# EasyEDA Pro project AT32M412_EVB_V0.4.eprj, board AT32M412_EVB_V0.4
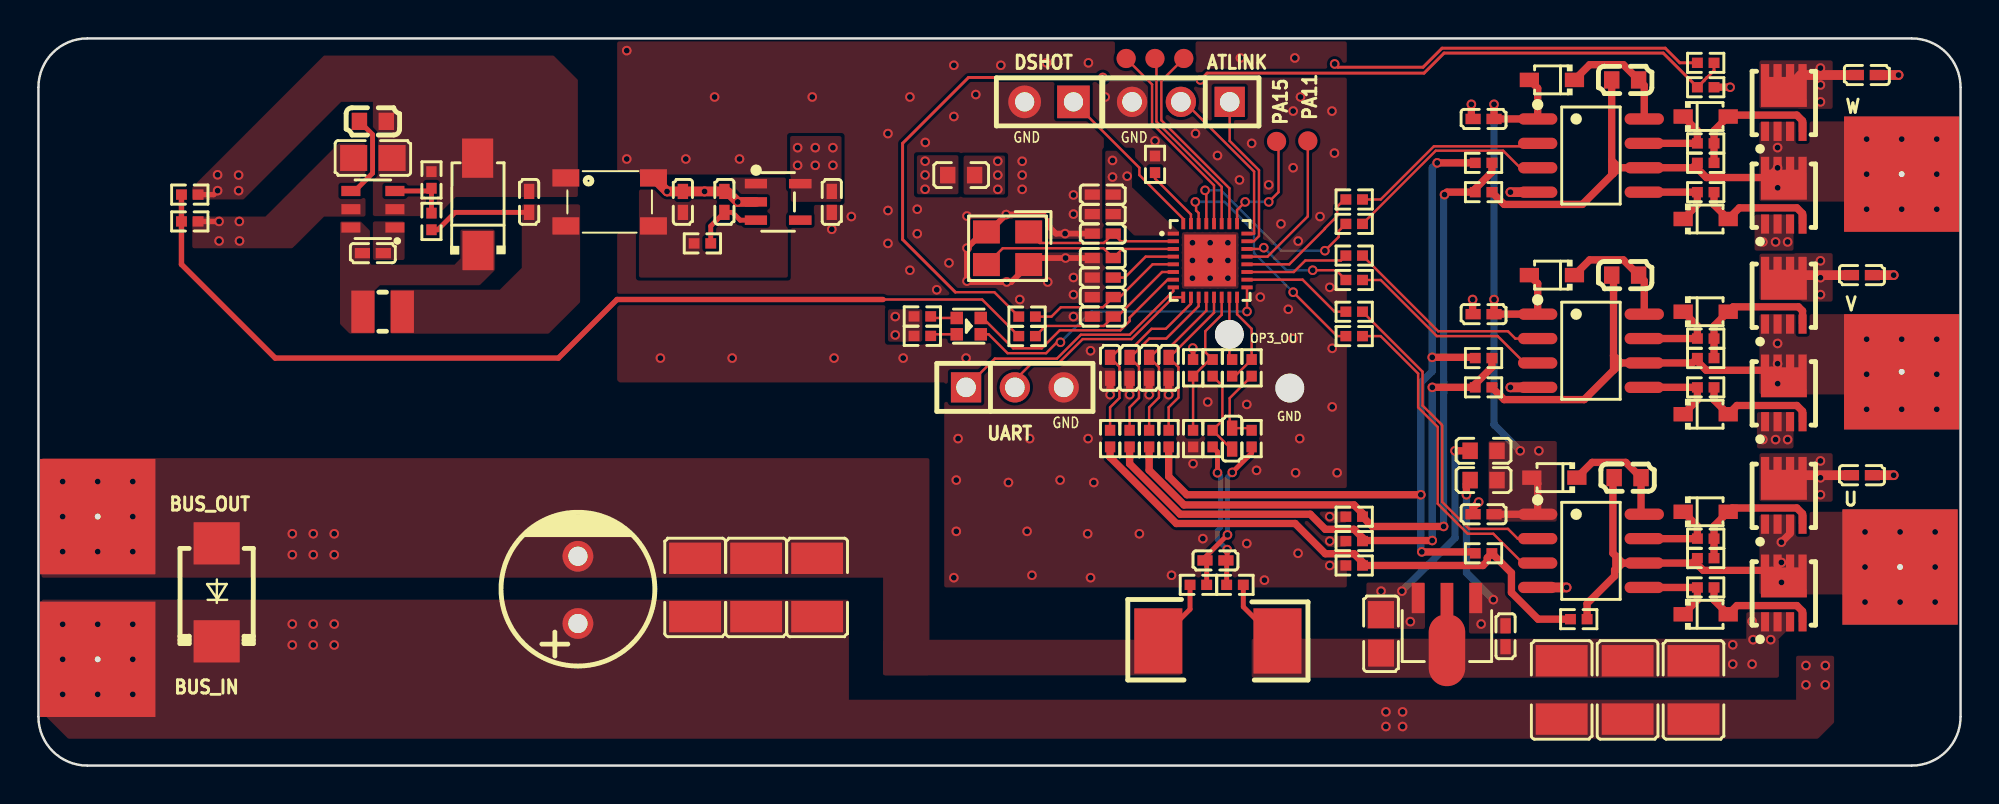
[diagram p4: board, top side]
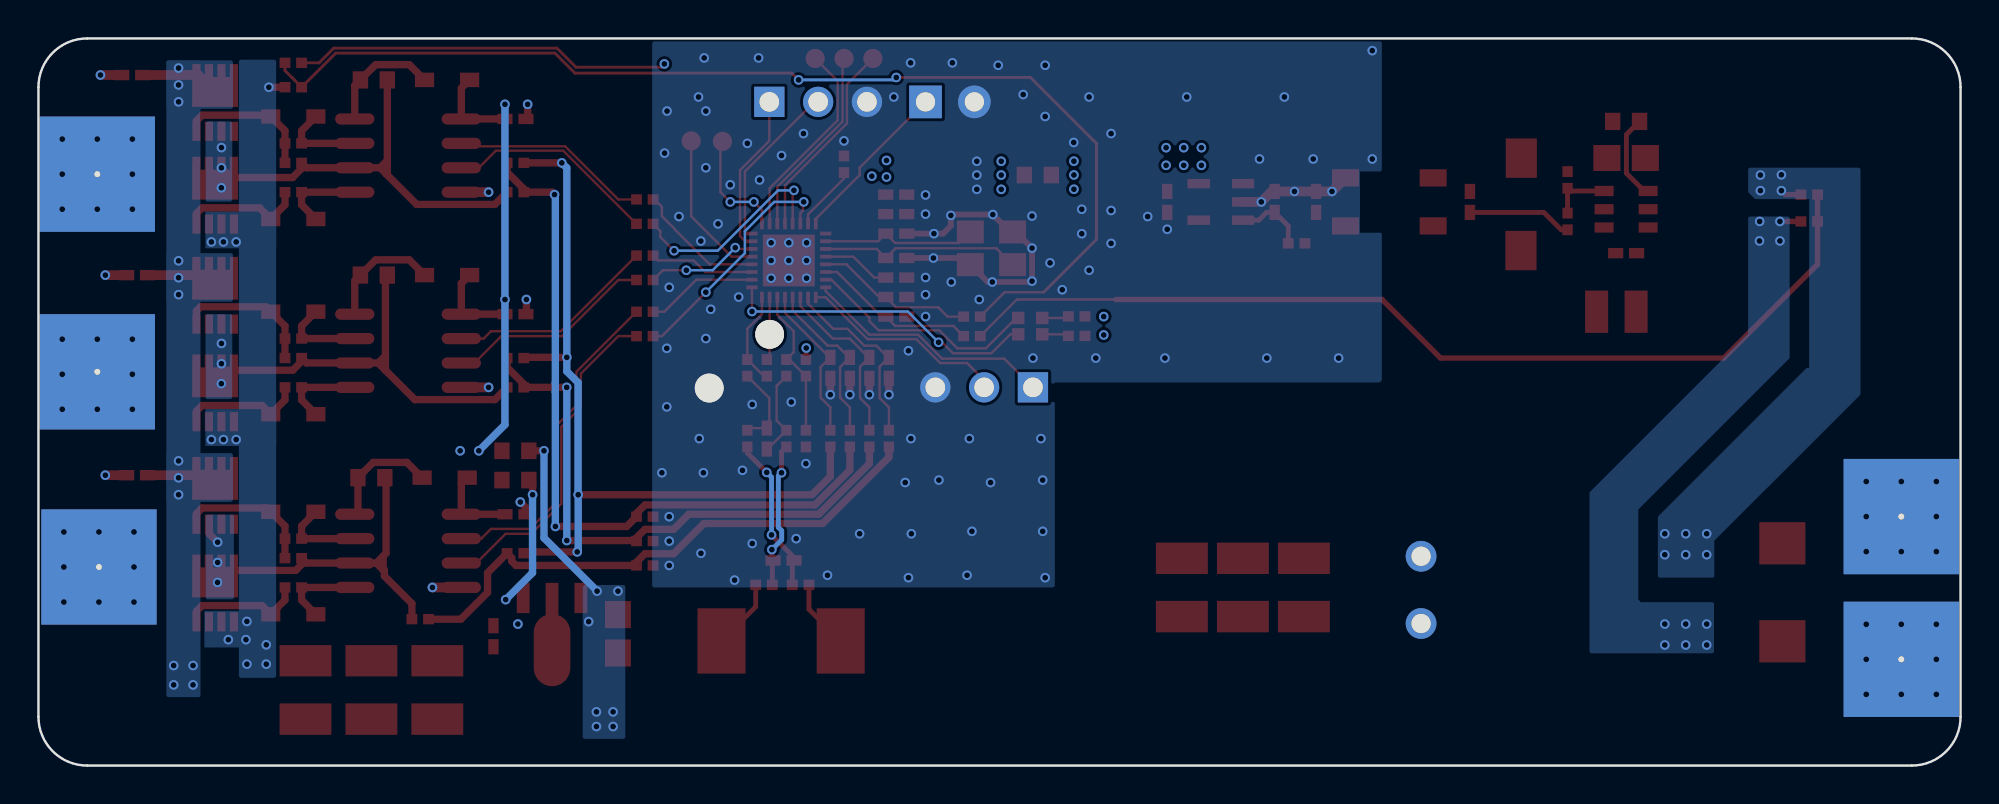
[diagram p5: board, bottom side, seen from below]

Outline 100 x 37.85 mm; copper layers: Top Layer, GND02, PWR03, Bottom Layer. Coordinates in mm from the lower left corner of the outline.
Outline path: 0,35.31 0,2.54 arc(0.74,0.74) 2.54,0 97.46,0 arc(99.26,0.74) 100,2.54 100,35.31 arc(99.26,37.1) 97.46,37.85 2.54,37.85 arc(0.74,37.1) 0,35.31
Stack: Top Layer 0.035mm 外层铜厚1oz / Dielectric1 0.2104mm 7628 RC49% 8.6mil / GND02 0.0152mm 内层铜厚 / Dielectric2 1.065mm 1.1mm H/HOZ Copper / PWR03 0.0152mm 内层铜厚 / Dielectric3 0.2104mm 7628 RC49% 8.6mil / Bottom Layer 0.035mm 外层铜厚1oz

## Design rules (mm)
template: 自定义配置
spacing copperThickness1oz (default): track to track 0.102, other pairs 0.152 to 0.3
spacing copperThickness2oz: track to track 0.203, other pairs 0.152 to 0.3
spacing edgeClearance: track to track 0.152, other pairs 0 to 0.152
track width copperThickness1oz (default): min 0.127, default 0.127, max 2.54
track width PWR: min 0.152, default 0.381, max 2.54
differential pair 90ohm (default): width min 0.152, default 0.152, max 0.152; gap min 0.178, default 0.178
via viaSize (default): diameter min 0.5, default 0.5, max 10; hole min 0.3, default 0.305, max 6.299
net GND uses PWR
net VBUS uses PWR
net GNDP uses PWR
net VCC_3V3 uses PWR
region e1533 uses edgeClearance
region e1534 uses edgeClearance
region e2249 uses edgeClearance
region e2274 uses edgeClearance
region e2275 uses edgeClearance

## Placement (name value [footprint] x y rotation side)
ATLINK  PM254V-11-03-H85  [HDR-TH_3P-P2.54-V-F]  59.44 34.54 180 top
BUS_IN  -  [PAD_35A]  4.35 5.02 180 top
BUS_OUT  -  [PAD_35A]  4.35 12.45 180 top
C131  100nF  [C0402]  55.37 28.7 0 top
C205  220uF  [CAP-TH_BD8.0-P3.50-D0.6-FD]  28.07 9.14 90 top
C208  10uF  [C0805]  17.4 31.62 180 top
C210  10uF  [C0402]  25.53 29.34 270 top
C211  100nF  [C0402]  55.37 25.4 0 top
C212  12pF  [C0402]  55.37 27.69 180 top
C213  12pF  [C0402]  55.37 26.42 0 top
C215  1uF  [C0603]  82.68 14.99 0 top
C217  1uF  [C0603]  82.55 25.53 0 top
C219  1uF  [C0603]  82.55 35.69 0 top
C220  2.2nF  [C0402]  61.23 10.68 180 top
C221  4.7uF  [C1210]  86.11 3.94 270 top
C225  100nF  [C0402]  55.37 23.37 0 top
C226  100nF  [C0402]  55.37 24.38 0 top
C227  33pF  [C0402]  55.75 20.7 90 top
C228  33pF  [C0402]  56.77 20.7 90 top
C229  33pF  [C0402]  57.79 20.7 90 top
C230  33pF  [C0402]  58.8 20.7 90 top
C231  100pF  [C0402]  62.1 17.02 270 top
C232  100nF  [C0402]  17.4 26.67 180 top
C234  10uF  [C0402]  33.53 29.34 270 top
C235  1uF  [C0402]  35.69 29.34 270 top
C236  1uF  [C0402]  41.27 29.34 90 top
C238  100nF  [C0402]  94.87 15.11 0 top
C239  100nF  [C0402]  94.87 25.53 0 top
C240  100nF  [C0402]  95.12 35.94 0 top
C241  100nF  [C0402]  76.33 6.73 270 top
C242  2.2uF  [C0603]  17.4 33.53 180 top
C245  4.7uF  [C1210]  34.16 9.27 270 top
C246  4.7uF  [C1210]  37.34 9.27 270 top
C247  4.7uF  [C1210]  40.51 9.27 270 top
C249  4.7uF  [C1210]  82.68 3.94 270 top
C250  4.7uF  [C1210]  79.25 3.94 270 top
C252  330nF  [C0805]  69.85 6.86 90 top
C253  10uF  [C0402]  55.37 29.72 0 top
C254  100nF  [C0402]  75.18 13.08 180 top
C255  100nF  [C0402]  75.18 23.5 180 top
C256  100nF  [C0402]  75.18 33.66 180 top
D37  1N4148WS  [SOD-323_L1.8-W1.3-LS2.5-RD]  78.87 14.99 180 top
D38  1N4148WS  [SOD-323_L1.8-W1.3-LS2.5-RD]  78.74 25.53 180 top
D39  1N4148WS  [SOD-323_L1.8-W1.3-LS2.5-RD]  78.74 35.69 180 top
D40  1N4148WS  [SOD-323_L1.8-W1.3-LS2.5-RD]  86.74 13.21 0 top
D41  1N4148WS  [SOD-323_L1.8-W1.3-LS2.5-RD]  86.74 23.62 0 top
D42  1N4148WS  [SOD-323_L1.8-W1.3-LS2.5-RD]  86.74 33.78 0 top
D43  1N4148WS  [SOD-323_L1.8-W1.3-LS2.5-RD]  86.74 7.87 0 top
D44  1N4148WS  [SOD-323_L1.8-W1.3-LS2.5-RD]  86.74 18.29 0 top
D45  1N4148WS  [SOD-323_L1.8-W1.3-LS2.5-RD]  86.74 28.45 0 top
D46  SS16  [SMA_L4.3-W2.6-LS5.0-RD]  22.86 29.21 90 top
DSHOT  2.54-1*2P母  [HDR-TH_2P-P2.54-V-F]  52.58 34.54 180 top
GND  -  [M3.5金属化螺丝孔]  65.1 19.65 0 top
L12  ACT45B-510-2P-TL003  [IND-SMD_4P-L4.5-W3.2-TL]  29.72 29.34 0 top
L13  BLM18AG102SN1D  [L0603]  48.01 30.73 0 top
L14  BLM18AG102SN1D  [L0603]  75.18 14.86 0 top
L15  NC  [L0603]  75.18 16.38 0 top
L16  10uH  [IND-SMD_L2.5-W2.0]  17.91 23.62 0 top
LDO1  ME6211C33M5G-N  [SOT-23-5_L3.0-W1.7-P0.95-LS2.8-BL]  38.48 29.34 270 top
LED1  NCD1615RG1  [LED-SMD_4P-L1.6-W1.5-TL-1]  48.4 22.87 180 top
OP3_OUT  -  [M3.5金属化螺丝孔]  61.96 22.44 0 top
PA11  -  [Mark-Point-1mm]  66.04 32.51 90 top
PA15  -  [Mark-Point-1mm]  64.41 32.48 90 top
PB3  -  [Mark-Point-1mm]  59.59 36.8 90 top
PB4  -  [Mark-Point-1mm]  58.09 36.8 90 top
PB5  -  [Mark-Point-1mm]  56.59 36.8 90 top
Q1  TMG60N04DF  [POWERDI3333-8_DMN7022LFGQ-7]  90.8 13.59 0 top
Q2  TMG60N04DF  [POWERDI3333-8_DMN7022LFGQ-7]  90.8 8.51 0 top
Q3  TMG60N04DF  [POWERDI3333-8_DMN7022LFGQ-7]  90.8 24 0 top
Q4  TMG60N04DF  [POWERDI3333-8_DMN7022LFGQ-7]  90.8 18.92 0 top
Q5  TMG60N04DF  [POWERDI3333-8_DMN7022LFGQ-7]  90.8 34.04 0 top
Q6  TMG60N04DF  [POWERDI3333-8_DMN7022LFGQ-7]  90.8 29.21 0 top
R186  82kΩ  [R0402]  20.45 28.32 90 top
R188  1kΩ  [R0402]  58.09 31.29 90 top
R189  1kΩ  [R0402]  45.99 23.38 0 top
R190  1kΩ  [R0402]  45.99 22.36 0 top
R191  10Ω  [R0402]  86.74 11.81 0 top
R192  10Ω  [R0402]  86.74 9.27 0 top
R193  10Ω  [R0402]  86.74 22.22 0 top
R194  10Ω  [R0402]  86.74 19.69 0 top
R195  10Ω  [R0402]  86.74 32.39 0 top
R196  10Ω  [R0402]  86.74 29.84 0 top
R197  10Ω  [R0402]  68.45 23.62 0 top
R198  10Ω  [R0402]  68.45 22.35 0 top
R199  10Ω  [R0402]  68.45 26.54 0 top
R200  10Ω  [R0402]  68.45 25.27 0 top
R201  10Ω  [R0402]  68.45 29.46 0 top
R202  10Ω  [R0402]  68.45 28.19 0 top
R203  2mΩ  [RES-SMD_L6.4-W3.2-1]  61.36 6.49 180 top
R204  10Ω  [R0402]  62.25 9.41 0 top
R205  10Ω  [R0402]  60.35 9.41 180 top
R206  NCP15XH103F03RC  [R0402]  86.74 35.31 180 top
R207  3kΩ  [R0402]  86.74 36.58 180 top
R208  100Ω  [R0402]  51.43 22.35 0 top
R209  100Ω  [R0402]  51.43 23.37 0 top
R211  51kΩ  [R0402]  75.18 11.05 0 top
R213  3kΩ  [R0402]  68.45 10.41 180 top
R214  43kΩ  [R0402]  80.14 7.62 0 top
R215  51kΩ  [R0402]  75.18 21.21 0 top
R216  43kΩ  [R0402]  75.18 19.69 0 top
R217  3kΩ  [R0402]  68.45 11.68 180 top
R218  51kΩ  [R0402]  75.18 31.37 0 top
R219  43kΩ  [R0402]  75.18 29.84 0 top
R220  3kΩ  [R0402]  68.45 12.95 180 top
R221  1Ω  [R0402]  55.75 17.02 90 top
R222  1Ω  [R0402]  56.77 17.02 90 top
R223  1Ω  [R0402]  57.79 17.02 90 top
R224  1Ω  [R0402]  58.8 17.02 90 top
R225  1.2kΩ  [R0402]  61.09 17.02 90 top
R226  1.2kΩ  [R0402]  63.12 17.02 90 top
R227  1.2kΩ  [R0402]  61.09 20.7 90 top
R228  1.2kΩ  [R0402]  63.12 20.7 90 top
R229  66.5kΩ  [R0402]  62.1 20.7 90 top
R230  47kΩ  [R0402]  7.87 28.32 180 top
R231  10kΩ  [R0402]  7.87 29.72 0 top
R237  133kΩ  [R0402]  60.07 20.7 270 top
R238  133kΩ  [R0402]  60.07 17.02 90 top
R239  200kΩ  [R0402]  86.74 10.8 0 top
R240  200kΩ  [R0402]  86.74 21.21 0 top
R241  200kΩ  [R0402]  86.74 31.37 0 top
R242  16kΩ  [R0402]  20.45 30.48 90 top
R243  10kΩ  [R0402]  34.54 27.18 180 top
U  -  [PAD_35A]  95.58 10.84 0 top
U34  AT32M412KBU7-4  [WQFN-32_L4.0-W4.0-P0.40-TL-EP2.7]  60.96 26.29 0 top
U41  SMBJ18A  [SMB_L4.5-W3.6-LS5.4-RD]  9.27 9.02 90 top
U43  CJ78L12  [SOT-89-3_L4.5-W2.5-P1.50-LS4.2-BR]  73.28 7.37 90 top
U44  LGS5145  [SOT-23-6_L2.9-W1.7-P0.95-LS2.8-BL]  17.4 28.96 90 top
U45  IRS21867STRPBF-JSM  [SOIC-8_L4.9-W3.9-P1.27-LS6.0-BL]  80.77 11.18 270 top
U46  IRS21867STRPBF-JSM  [SOIC-8_L4.9-W3.9-P1.27-LS6.0-BL]  80.77 21.59 270 top
U47  IRS21867STRPBF-JSM  [SOIC-8_L4.9-W3.9-P1.27-LS6.0-BL]  80.77 31.75 270 top
UART  PM254V-11-03-H85  [HDR-TH_3P-P2.54-V-F]  50.8 19.69 0 top
V  -  [PAD_35A]  95.67 21 0 top
W  -  [PAD_35A]  95.67 31.29 0 top
X3  24MHz  [CRYSTAL-SMD_4P-L3.2-W2.5-BL]  50.42 26.92 180 top

## Footprints (pads in the part's own frame, mm; a bottom-side part is the same pattern mirrored in y, then rotated)
C0402
  rect 0.79x0.54 smd: 1(-0.545,0) 2(0.545,0)
C0603
  rect 0.8x0.9 smd: 1(-0.7,0) 2(0.7,0)
C0805
  rect 1.41x1.35 smd: 1(-1,0) 2(1,0)
C1210
  rect 1.635x2.7 smd: 1(-1.518,0) 2(1.518,0)
CAP-TH_BD8.0-P3.50-D0.6-FD
  round 1.6 hole 1: 1(-1.75,0) 2(1.75,0)
CRYSTAL-SMD_4P-L3.2-W2.5-BL
  rect 1.4x1.2 smd: 1(-1.1,-0.85) 2(1.1,-0.85) 3(1.1,0.85) 4(-1.1,0.85)
HDR-TH_2P-P2.54-V-F
  rect 1.7x1.7 hole 1: 1(-1.27,0)
  round 1.7 hole 1: 2(1.27,0)
HDR-TH_3P-P2.54-V-F
  rect 1.575x1.575 hole 1.02: 1(-2.54,0)
  round 1.575 hole 1.02: 2(0,0) 3(2.54,0)
IND-SMD_4P-L4.5-W3.2-TL
  rect 1.4x0.9 smd: 1(-2.28,1.25) 2(-2.28,-1.25) 3(2.28,-1.25) 4(2.28,1.25)
IND-SMD_L2.5-W2.0
  rect 1.2x2.2 smd: 1(1.028,0) 2(-1.028,0)
L0603
  rect 0.8x0.864 smd: 1(-0.7,0) 2(0.7,0)
LED-SMD_4P-L1.6-W1.5-TL-1
  rect 0.65x0.65 smd: 1(-0.625,0.425) 2(0.625,0.425) 3(-0.625,-0.425) 4(0.625,-0.425)
M3.5金属化螺丝孔
  round 1.5 hole 3.5x1: 1(0,0)
Mark-Point-1mm
  round 1 smd: 1(0,0)
PAD_35A
  rect 6x6 hole 0.305: 1(1.27,-0.508)
POWERDI3333-8_DMN7022LFGQ-7
  rect 0.42x1 smd: 1(-0.975,-1.025) 2(-0.325,-1.025) 3(0.325,-1.025) 4(0.975,-1.025)
  custom 2.39x2.23 smd: 5(0.005,1.025)
R0402
  rect 0.566x0.54 smd: 1(-0.433,0) 2(0.433,0)
RES-SMD_L6.4-W3.2-1
  rect 2.5x3.4 smd: 1(-3.1,0) 2(3.1,0)
SMA_L4.3-W2.6-LS5.0-RD
  rect 2.046x1.62 smd: 1(-2.404,-0.009) 2(2.404,0.009)
SMB_L4.5-W3.6-LS5.4-RD
  rect 2.2x2.4 smd: 1(-2.551,0) 2(2.551,0)
SOD-323_L1.8-W1.3-LS2.5-RD
  rect 1x0.75 smd: 1(-1.173,0) 2(1.173,0)
SOIC-8_L4.9-W3.9-P1.27-LS6.0-BL
  oval 0.588x2.045 smd: 1(-1.905,-2.772) 2(-0.635,-2.772) 3(0.635,-2.772) 4(1.905,-2.772) 5(1.905,2.772) 6(0.635,2.772) 7(-0.635,2.772) 8(-1.905,2.772)
SOT-23-5_L3.0-W1.7-P0.95-LS2.8-BL
  rect 0.49x1.157 smd: 1(-0.95,-1.153) 2(0,-1.153) 3(0.95,-1.153)
  rect 0.49x1.175 smd: 4(0.95,1.153) 5(-0.95,1.153)
SOT-23-6_L2.9-W1.7-P0.95-LS2.8-BL
  rect 0.532x0.99 smd: 1(-0.95,-1.145) 2(0,-1.145) 3(0.95,-1.145) 4(0.95,1.145) 5(0,1.145) 6(-0.95,1.145)
SOT-89-3_L4.5-W2.5-P1.50-LS4.2-BR
  rect 1.575x0.672 smd: 1(1.356,-1.5) 3(1.356,1.5)
  custom 5.377x1.9 smd: 2(-1.356,0)
WQFN-32_L4.0-W4.0-P0.40-TL-EP2.7
  rect 0.585x0.2 smd: 1(-1.917,1.4) 2(-1.917,1) 3(-1.917,0.6) 4(-1.917,0.2) 5(-1.917,-0.2) 6(-1.917,-0.6) 7(-1.917,-1) 8(-1.917,-1.4) 17(1.917,-1.4) 18(1.917,-1) 19(1.917,-0.6) 20(1.917,-0.2) 21(1.917,0.2) 22(1.917,0.6) 23(1.917,1) 24(1.917,1.4)
  rect 0.2x0.585 smd: 9(-1.4,-1.917) 10(-1,-1.917) 11(-0.6,-1.917) 12(-0.2,-1.917) 13(0.2,-1.917) 14(0.6,-1.917) 15(1,-1.917) 16(1.4,-1.917) 25(1.4,1.917) 26(1,1.917) 27(0.6,1.917) 28(0.2,1.917) 29(-0.2,1.917) 30(-0.6,1.917) 31(-1,1.917) 32(-1.4,1.917)
  rect 2.7x2.7 smd: 33(0,0)

## Nets
As in the schematic.

Pads without a net: LDO1 4

## Via types
v1: diameter 0.5, hole 0.305, Top Layer to Bottom Layer, 278 vias

## Routing (per net, layer and track width the routed paths; a pad name or vN(x,y) marks a point on that pad's centre or on a via; arc(x,y) is an arc through that point)
GND: length 26
  Top Layer w0.305: C212.2 v1(53.41,27.69) 52.94,27.69 52.53,28.09 v1(52.53,28.63) 52.48,28.68 v1(50.35,28.68) 49.44,27.77 X3.2 49.15,27.77 v1(48.31,26.93) v1(48.31,25.22) 48.35,25.17 50.61,25.17 X3.4 51.86,26.42 v1(53.44,26.42) C213.1
  Top Layer w0.381: C230.1 v1(58.8,19.3) ; C229.1 v1(57.79,19.3) ; C227.1 v1(55.75,19.3) ; C228.1 v1(56.77,19.3)
  Top Layer w0.508: L12.4 v1(32.7,29.88) C234.1 v1(34.66,29.88) C235.1 35.72,29.84 35.87,29.84 v1(36.38,29.34) LDO1.2
  vias: v1(30.61,37.21) v1(30.61,31.57) v1(32.36,21.21) v1(33.68,31.57) v1(35.18,34.8) v1(36.09,21.21) v1(36.48,31.57) v1(40.26,34.8) v1(41.27,27.91) v1(41.39,21.21) v1(42.29,28.58) v1(44.2,32.89) v1(44.2,28.89) v1(44.2,27.18) v1(44.99,21.21) v1(45.34,34.8) v1(45.34,25.78) v1(45.72,28.96) v1(45.72,27.68) v1(46.14,32.43) v1(46.74,24.77) v1(47.37,26.16) v1(47.63,36.45) v1(47.63,33.78) v1(47.63,9.78) v1(47.75,14.86) v1(47.75,12.19) v1(47.85,17.02) v1(48.26,21.21) v1(48.31,28.6) v1(48.77,34.92) v1(50.07,36.45) v1(50.38,25.17) v1(50.46,14.73) v1(51.05,24.26) v1(51.18,31.45) v1(51.18,30.73) v1(51.18,29.99) v1(51.43,12.19) v1(51.57,17.02) v1(51.69,9.91) v1(52.45,36.58) v1(52.51,25.17) v1(53.15,14.86) v1(53.85,29.7) v1(53.85,28.7) v1(53.85,25.4) v1(53.85,24.51) v1(53.85,23.37) v1(54.59,12.06) v1(54.63,36.58) v1(54.61,17.02) v1(54.74,21.59) v1(54.74,9.78) v1(54.91,14.73) v1(55.5,34.8) v1(57.28,12.06) v1(58.09,32.51) v1(58.95,9.91) v1(60.04,27.21) v1(60.04,26.29) v1(60.04,25.37) v1(60.07,15.71) v1(60.2,32.89) v1(60.58,11.81) v1(60.83,18.92) v1(60.96,27.21) v1(60.96,26.29) v1(60.96,25.37) v1(61.34,31.75) v1(61.88,27.21) v1(61.88,26.29) v1(61.88,25.37) v1(62.48,30.48) v1(62.53,36.83) v1(62.86,18.8) v1(62.86,11.56) v1(63.12,32.39) v1(63.37,15.37) v1(63.57,24.38) v1(63.78,9.65) v1(64.01,30.23) v1(64.64,28.19) v1(65.02,23.75) v1(65.28,34.07) v1(65.28,31.11) v1(65.28,22.22) v1(65.36,36.83) v1(65.41,15.24) v1(65.54,27.3) v1(65.53,11.05) v1(65.66,34.8) v1(65.62,17.02) v1(66.67,28.58) v1(67.18,24.89) v1(67.18,12.95) v1(67.18,11.68) v1(67.18,10.41) v1(67.3,34.07) v1(67.31,21.72) v1(67.31,18.67) v1(67.42,31.88) v1(67.56,15.24)
GND_IN: length 4.7
  Top Layer w0.254: R203.2 59.91,8.14 R205.2
  Top Layer w0.28: v1(9.32,29.92) 9.12,29.72 R231.2
  vias: v1(1.26,14.78) v1(1.26,12.96) v1(1.26,11.14) v1(3.08,14.78) v1(3.08,11.14) v1(4.91,14.78) v1(4.91,12.96) v1(4.91,11.14) v1(9.32,30.75) v1(10.41,30.73) v1(10.41,29.92) v1(13.21,12.06) v1(13.21,10.97) v1(14.3,12.06) v1(14.3,10.97) v1(15.39,12.06) v1(15.39,10.97)
GNDP: length 14.5
  Top Layer w0.254: R203.1 62.68,8.26 R204.2
  Top Layer w0.381: C254.2 74.64,13.42 v1(74.93,13.72) ; R206.1 v1(88.01,35.31) ; v1(74.55,34.42) 74.55,33.75 C256.2 ; 74.7,23.5 74.61,23.58 v1(74.61,24.26)
  Top Layer w0.508: U47.4 v1(76.58,29.84) ; C239.2 v1(96.52,25.53) ; U45.4 v1(79.5,9.27) ; C240.2 v1(96.77,35.94) ; U46.4 v1(76.58,19.69) ; C238.2 v1(96.52,15.11)
  vias: v1(88.15,6.29) v1(88.15,5.28) v1(89.16,7.5) v1(89.16,5.28) v1(89.2,6.55) v1(89.71,27.25) v1(89.71,16.97) v1(90.12,6.55) v1(90.38,27.25) v1(90.38,16.97) v1(91,27.25) v1(91,16.97)
VBUS: length 21.9
  Top Layer w0.28: v1(9.4,28.32) R230.1
  Top Layer w0.381: 74.48,16.38 v1(73.7,16.38)
  Top Layer w0.508: Q1.5 91.31,15.11 94.32,15.11 ; C240.1 91.69,35.94 Q5.5 ; Q3.5 91.31,25.53 94.32,25.53
  Bottom Layer w0.381: v1(73.7,16.38) 73.7,11.85 70.94,9.09 v1(70.94,9.08)
  vias: v1(1.26,7.35) v1(1.26,5.53) v1(1.26,3.71) v1(3.08,7.35) v1(3.08,3.71) v1(4.91,7.35) v1(4.91,5.53) v1(4.91,3.71) v1(9.4,27.31) v1(10.45,28.32) v1(10.46,27.31) v1(13.21,7.37) v1(13.21,6.28) v1(14.3,7.37) v1(14.3,6.28) v1(15.39,7.37) v1(15.39,6.28) v1(69.85,9.08) v1(70.1,2.79) v1(70.1,2.03) v1(70.97,2.79) v1(70.97,2.03) v1(71.37,7.49) v1(91.96,5.21) v1(91.96,4.2) v1(92.71,36.3) v1(92.71,35.42) v1(92.71,34.54) v1(92.71,26.27) v1(92.71,25.39) v1(92.71,24.51) v1(92.71,15.86) v1(92.71,14.98) v1(92.71,14.1) v1(92.96,5.21) v1(92.96,4.2)
VBUS_REF: length 51.3
  Top Layer w0.127: 43.94,24.26 49.1,24.26 R208.1
  Top Layer w0.28: R231.1 R230.2 7.44,26.09 12.32,21.21 27.05,21.21 30.1,24.26 43.94,24.26
VCC_3V3:
  vias: v1(39.5,32.16) v1(39.5,31.24) v1(40.42,32.16) v1(40.42,31.24) v1(41.33,32.16) v1(41.33,31.24) v1(46.13,31.46) v1(46.13,30.74) v1(46.13,30)
VCC_5V: length 5.5
  Top Layer w0.254: R186.1 20.78,27.89 21.68,28.79 C210.2
VCC_12V: length 6.9
  Top Layer w0.381: 74.48,14.86 74.29,14.67 v1(74.29,14.1)
  Bottom Layer w0.381: v1(74.29,14.1) 74.3,14.09 74.3,10.03 v1(75.69,8.64)
  vias: v1(75.06,7.37)
VDD_3V3: length 20.3
  Top Layer w0.152: R207.2 85.4,36.58 84.64,37.34 73.02,37.34 72.04,36.35 67.61,36.35 v1(67.44,36.52)
  Top Layer w0.254: v1(60.06,21.73) 60.07,21.72 R237.1
  vias: v1(44.58,23.37) v1(44.58,22.41) v1(49.91,31.45) v1(49.91,30.73) v1(49.91,29.99) v1(55.88,31.5) v1(55.88,30.63) v1(56.64,30.68)
BOOT0: length 3.4
  Top Layer w0.127: R188.1 58.09,30.56 59.96,28.69 U34.31
COM_NUTRAL: length 42.7
  Top Layer w0.381: R218.1 v1(72.77,31.37) ; v1(71.92,14.1) 59.75,14.1 58.8,15.05 R224.1 ; R215.1 74.71,21.25 v1(72.51,21.25) ; v1(71.97,11.12) 74.68,11.12 R211.1
  Bottom Layer w0.381: v1(71.97,11.12) 71.92,11.17 v1(71.92,14.1) 71.92,14.1 71.92,19.93 72.51,20.52 v1(72.51,21.25) 72.51,31.11 v1(72.77,31.37)
EMF1: length 29.3
  Top Layer w0.381: 79.7,7.62 78.02,7.62 76.63,9.01 76.63,10.03 R211.2 75.38,10.81 75.38,10.64 75.15,10.41 68.89,10.41 68.89,10.59 68.45,11.03 66.95,11.03 65.38,12.6 59.2,12.6 55.75,16.05 R221.1
EMF2: length 30.5
  Top Layer w0.381: R215.2 75.62,20.72 74.75,19.86 R216.1 v1(72.52,19.69) ; v1(72.51,11.71) 68.92,11.71 68.89,11.68 68.89,11.86 68.45,12.3 66.95,12.3 66.17,13.08 59.4,13.08 56.77,15.71 R222.1
  Bottom Layer w0.381: v1(72.52,19.69) 72.51,19.68 v1(72.51,11.71)
EMF3: length 38.7
  Top Layer w0.381: R223.1 57.79,15.38 59.6,13.57 68.45,13.57 68.89,13.13 68.89,12.95 69.39,12.45 v1(73.11,12.45) ; v1(73.15,29.72) 73.28,29.84 R219.1 74.75,30.02 75.62,30.88 R218.2
  Bottom Layer w0.381: v1(73.11,12.45) 73.11,19.44 73.11,19.44 73.11,19.93 73.11,19.94 73.11,29.67 v1(73.15,29.72)
EMF_NUTRAL: length 8.3
  Top Layer w0.127: R224.2 58.8,18.64 59.31,19.15 59.31,20.74 C230.2 58.84,21.25 61.16,23.57 U34.13
EMF_U: length 9.9
  Top Layer w0.127: R221.2 55.75,18.64 56.24,19.13 56.24,20.76 C227.2 55.8,21.25 56.41,21.86 57.04,21.86 57.91,22.73 58.65,22.73 59.96,24.04 U34.10
EMF_V: length 9.4
  Top Layer w0.127: U34.11 60.36,23.91 58.67,22.22 57.79,22.22 56.81,21.25 C228.2 57.26,20.76 57.26,19.13 56.77,18.64 R222.2
EMF_W: length 8.9
  Top Layer w0.127: U34.12 60.76,23.68 58.94,21.86 58.44,21.86 57.83,21.25 C229.2 58.29,20.74 58.29,19.15 57.79,18.64 R223.2
FB: length 3.3
  Top Layer w0.254: U44.3 20.31,29.91 R242.1 R186.2
I_BUS_GND: length 8.2
  Top Layer w0.254: R205.1 60.78,10.59 C220.2 60.69,10.84 v1(61.86,12.01) ; R226.1 63.12,16.27 v1(62.11,15.26)
  Bottom Layer w0.254: v1(62.11,15.26) 61.86,15.01 v1(61.86,12.01)
I_BUS_SHUNT: length 7.7
  Top Layer w0.254: v1(61.84,11.24) 61.84,10.74 61.78,10.68 61.82,10.64 R204.1 ; v1(61.34,15.24) 61.34,16.33 R225.1
  Bottom Layer w0.254: v1(61.34,15.24) 61.51,15.08 61.51,12.4 61.33,12.23 61.33,11.75 v1(61.84,11.24)
LED_G: length 16.4
  Top Layer w0.127: v1(62.88,23.63) U34.17 ; v1(53.17,22.03) 52.99,22.03 52.42,21.46 50.42,21.46 49.44,22.45 LED1.1
  Bottom Layer w0.127: v1(53.17,22.03) 54.77,23.63 v1(62.88,23.63)
LED_R: length 12.3
  Top Layer w0.127: U34.7 58.74,25.29 56.77,23.31 56.77,23.13 56.29,22.65 53.13,22.65 52.2,21.72 50.71,21.72 49.13,23.3 LED1.3
MOS_NTC: length 58.5
  Top Layer w0.127: 47.7,24.64 49.73,24.64 R209.1
  Top Layer w0.152: v1(55.37,35.81) 48.39,35.81 44.96,32.39 44.96,27.38 47.7,24.64 ; R207.1 87.17,36.17 86.81,35.8 86.8,35.8 86.66,35.67 86.66,35.66 R206.2 84.53,37.08 73.13,37.08 72.09,36.04 60.8,36.04 v1(60.45,35.69)
  Bottom Layer w0.152: v1(60.45,35.69) 55.5,35.69 v1(55.37,35.81)
MOS_TEMP: length 8.3
  Top Layer w0.127: U34.5 57.97,26.09 56.26,24.38 C226.2 55.39,23.85 53.19,23.85 52.7,23.37 R209.2
NRST: length 3.6
  Top Layer w0.127: U34.4 57.6,26.49 56.52,25.4 C211.2
OP3_INM_BUS: length 4.9
  Top Layer w0.127: R229.1 62.25,20.27 R228.2 63.12,22.73 62.36,23.49 U34.16
OP3_INP_BUS: length 7.9
  Top Layer w0.127: U34.14 61.56,23.46 60.71,22.61 60.71,21.52 R227.2 60.94,21.13 R237.2 R238.2
OP3_OUT_BUS: length 3.3
  Top Layer w0.127: R229.2 61.96,21.28 OP3_OUT.1 U34.15
OSC_IN: length 8
  Top Layer w0.127: U34.2 56.31,27.29 C212.1 ; X3.1 52.09,27.2 55.43,27.2 55.85,27.62
OSC_OUT: length 10.4
  Top Layer w0.127: 55.85,26.48 55.41,26.92 50.17,26.92 X3.3 ; U34.3 56.39,26.89 C213.2
OUT1: length 19.5
  Top Layer w0.381: 82.42,10.54 82.07,10.18 ; 82.42,10.54 82.07,10.9 ; 82.42,10.54 U45.6 86.05,10.54 R239.1 86.31,10.47 86.61,10.16 90.18,10.16 Q2.5 ; 82.07,10.18 82.07,10.9 ; 82.07,10.18 82,10.18 82,9.86 80.57,8.43 R214.2 ; 82.07,10.9 81.92,11.05 81.92,14.92 C215.1 ; v1(90.68,11.63) 91.13,12.08 91.13,12.56
  vias: v1(90.68,10.57) v1(90.68,9.53) v1(95.03,12.16) v1(95.03,10.33) v1(95.03,8.51) v1(96.85,12.16) v1(96.85,8.51) v1(98.68,12.16) v1(98.68,10.33) v1(98.68,8.51)
OUT2: length 22.5
  Top Layer w0.381: 82.33,20.95 U46.6 86.05,20.95 R240.1 86.31,21.04 86.77,20.57 90.18,20.57 Q4.5 ; 82.33,20.95 81.95,21.34 ; 82.33,20.95 81.96,20.59 ; 81.95,21.34 81.95,20.61 81.96,20.59 ; 81.95,21.34 81.95,25.43 C217.1 ; R216.2 76.25,19.05 80.42,19.05 81.96,20.59
  vias: v1(90.48,21.97) v1(90.48,20.92) v1(90.48,19.88) v1(95.11,22.19) v1(95.11,20.37) v1(95.11,18.54) v1(96.94,22.19) v1(96.94,18.54) v1(98.76,22.19) v1(98.76,20.37) v1(98.76,18.54)
OUT3: length 22.2
  Top Layer w0.381: 81.92,30.8 80.32,29.21 76.25,29.21 R219.2 ; 81.92,30.8 82.23,31.11 ; 81.92,30.8 81.85,30.87 81.85,31.5 ; 82.23,31.11 81.85,31.5 ; 82.23,31.11 U47.6 86.05,31.11 R241.1 86.31,31.07 86.78,30.61 89.98,30.61 v1(90.48,31.11) ; 81.85,31.5 C219.1
  vias: v1(90.48,32.16) v1(90.48,30.07) v1(95.11,32.61) v1(95.11,30.78) v1(95.11,28.96) v1(96.94,32.61) v1(96.94,28.96) v1(98.76,32.61) v1(98.76,30.78) v1(98.76,28.96)
PWM_IN_DSHOT: length 8.7
  Top Layer w0.127: DSHOT.1 57.28,31.11 57.28,30.73 59.56,28.45 U34.32
SWCLK: length 8.9
  Top Layer w0.127: U34.24 63.25,27.69 63.25,30.92 59.62,34.54 ATLINK.2
SWDIO: length 8.4
  Top Layer w0.127: U34.23 63.23,27.29 63.5,27.56 63.5,30.99 61.98,32.51 ATLINK.1
TIM1_CH1: length 5.8
  Top Layer w0.127: R197.1 67.44,23.62 65.77,25.29 U34.18
TIM1_CH1N: length 12.7
  Top Layer w0.127: v1(65.28,24.64) 67.56,22.35 R198.1 ; v1(60.19,29.34) 60.2,29.34 60.23,29.37 60.23,28.89 60.36,28.76 U34.30
  Bottom Layer w0.127: v1(60.19,29.34) 61.72,29.34 63.25,27.81 63.25,26.67 v1(65.28,24.64)
TIM1_CH2: length 5.5
  Top Layer w0.127: U34.19 65.31,25.69 65.91,26.29 67.77,26.29 R199.1
TIM1_CH2N: length 5.9
  Top Layer w0.127: v1(66.29,25.78) 67.51,25.78 R200.1 ; U34.22 63.68,26.89 v1(63.75,26.95)
  Bottom Layer w0.127: v1(63.75,26.95) 64.92,25.78 v1(66.29,25.78)
TIM1_CH3: length 6.8
  Top Layer w0.127: U34.20 65.08,26.09 66.93,27.94 66.93,27.96 67.56,28.6 67.56,29.08 67.95,29.46 R201.1
TIM1_CH3N: length 11.1
  Top Layer w0.127: R202.1 67.65,27.82 67.65,27.52 v1(66.93,26.8) ; v1(60.7,29.94) 60.76,29.87 U34.29
  Bottom Layer w0.127: v1(66.93,26.8) 64.66,26.8 61.52,29.94 v1(60.7,29.94)
UART_RX: length 10.9
  Top Layer w0.127: U34.9 59.04,24.37 56.87,22.2 54.33,22.2 53.08,20.95 51.69,20.95 50.8,20.06 UART.2
UART_TX: length 13.1
  Top Layer w0.127: U34.8 59.04,24.69 56.77,22.42 54.23,22.42 52.99,21.18 49.76,21.18 UART.1
V_BUS_FB: length 8.6
  Top Layer w0.127: R208.2 52.4,22.88 55.43,22.88 C225.2 56.13,23.37 58.45,25.69 U34.6
VBOOST: length 33.4
  Top Layer w0.381: v1(75.73,24.26) C255.1 U46.1 78,25.09 D38.2 ; D37.2 78,14.68 U45.1 C254.1 ; D39.2 78,35.25 U47.1 C256.1 v1(75.73,34.42)
  Bottom Layer w0.381: v1(77.09,16.38) 75.73,17.74 v1(75.73,24.26) v1(75.73,34.42)
  vias: v1(78.06,16.38)
$1N26061: length 4.5
  Top Layer w0.254: C242.2 17.38,32.84 17.38,30.83 16.46,29.91 U44.4
$1N26456: length 3.7
  Top Layer w0.254: LDO1.3 36.51,28.39 36.11,28.79 C235.2 34.98,28.08 R243.1
$2N17344: length 8
  Top Layer w0.127: U34.21 63.94,26.49 66.04,28.59 PA11.1
$2N17781: length 5.9
  Top Layer w0.127: v1(62.78,29.34) 62.36,28.92 U34.25 ; PA15.1 64.52,32.38 64.52,29.84 v1(64.01,29.34)
  Bottom Layer w0.127: v1(62.78,29.34) v1(64.01,29.34)
$2N18473: length 1.4
  Top Layer w0.127: LED1.4 46.5,23.3 46.42,23.38
$2N18489: length 1.4
  Top Layer w0.127: 46.42,22.36 46.5,22.45 LED1.2
$2N29618: length 10.5
  Top Layer w0.127: U34.28 61.16,30.2 57.94,33.42 57.94,35.45 PB5.1
$2N29622: length 10
  Top Layer w0.127: U34.27 61.56,30.12 58.17,33.52 58.17,36.72 PB4.1
$2N29627: length 10.5
  Top Layer w0.127: PB3.1 58.42,35.63 58.42,33.59 61.96,30.05 U34.26
$9N2053: length 6.1
  Top Layer w0.381: D38.1 80.71,26.32 82.46,26.32 83.54,25.23 U46.8
$9N2529: length 6.1
  Top Layer w0.381: U47.8 83.54,35.39 82.46,36.48 80.71,36.48 D39.1
$9N2585: length 17.4
  Top Layer w0.127: U45.2 76.96,11.81 76.45,12.32 74.43,12.32 73.02,13.72 73.02,17.72 72.01,18.74 72.01,20.5 68.89,23.62
$9N2628: length 17.4
  Top Layer w0.127: 68.89,22.35 69.83,22.35 71.78,20.4 71.78,18.64 72.8,17.63 72.8,13.63 74.36,12.06 75.69,12.06 77.22,10.54 U45.3
$9N2671: length 10.9
  Top Layer w0.127: 78,22.22 76.83,22.22 76.45,22.61 72.82,22.61 68.89,26.54
$9N2714: length 10.9
  Top Layer w0.127: 68.89,25.27 69.83,25.27 72.75,22.35 75.92,22.35 77.32,20.95 U46.3
$9N2757: length 10.3
  Top Layer w0.127: U47.2 77.85,32.23 72.6,32.23 69.83,29.46 68.89,29.46
$9N2800: length 11.1
  Top Layer w0.127: U47.3 77.09,31.11 76.2,32 72.7,32 68.89,28.19
$9N18837: length 6
  Top Layer w0.381: U45.8 83.38,13.25 C215.2 82.58,15.78 80.83,15.78 D37.1
$9N19265: length 4.5
  Top Layer w0.381: U45.7 R191.1 86.31,12.47 D40.1
$9N19403: length 7.5
  Top Layer w0.381: Q3.4 91.78,23.66 91.57,23.88 88.17,23.88 D41.2 87.17,22.88 R193.2 R240.2
$9N19409: length 4.5
  Top Layer w0.381: 83.54,22.22 R193.1 86.31,22.88 D41.1
$9N19423: length 7.3
  Top Layer w0.381: Q5.4 91.78,33.56 91.48,33.85 87.99,33.85 D42.2 87.17,33.04 R195.2 R241.2
$9N19429: length 4.5
  Top Layer w0.381: U47.7 R195.1 86.31,33.04 D42.1
$9N19478: length 6.4
  Top Layer w0.381: Q2.4 91.78,8.03 91.48,8.33 88.37,8.33 D43.2 87.17,8.61 R192.2
$9N19485: length 4.5
  Top Layer w0.381: U45.5 R192.1 86.31,8.61 D43.1
$9N19572: length 6.5
  Top Layer w0.381: Q6.4 91.78,28.73 91.48,29.03 88.49,29.03 D45.2 87.17,29.19 R196.2
$9N19578: length 4.5
  Top Layer w0.381: D45.1 86.31,29.19 R196.1 U47.5
$9N19590: length 6.4
  Top Layer w0.381: Q4.4 91.78,18.44 91.48,18.74 88.37,18.74 D44.2 87.17,19.03 R194.2
$9N19596: length 4.5
  Top Layer w0.381: D44.1 86.31,19.03 R194.1 U46.5
$9N21132: length 7.3
  Top Layer w0.381: Q1.4 91.78,13.11 91.48,13.41 88.11,13.41 D40.2 87.17,12.47 R191.2 R239.2
$10N1086: length 4.3
  Top Layer w0.127: R226.2 63.01,17.56 C231.1 61.98,17.69 61.98,19.12 R228.1
$10N1091: length 4.7
  Top Layer w0.127: R227.1 61.6,19.76 61.6,17.96 R225.2 62.07,16.47 C231.2

## Copper pours and planes (outline as drawn; the poured copper is in the pictures)
GND on Top Layer: 30.11,37.85 30.11,20.06 30.23,19.94 47.12,19.94 47.12,9.27 68.07,9.27 68.07,37.72 67.95,37.85
GND on Bottom Layer: 30.11,37.85 30.11,20.06 30.23,19.94 47.12,19.94 47.12,9.27 68.07,9.27 68.07,37.72 67.95,37.85
GND on GND02: 30.11,37.69 68.07,37.69 68.07,9.29 30.11,9.29
GND_IN on Top Layer: 43.94,9.78 0,9.78 0,16 46.36,16 46.36,4.7 43.94,4.7
GND_IN on Top Layer: 43.94,6.55 59.46,6.55 59.46,4.7 43.94,4.7
GND_IN on Top Layer: 8,29.46 10.67,29.46 15.75,34.54 17.4,34.54 17.4,28.6 20.72,28.6 21.72,29.59 28.07,29.59 28.07,35.69 26.8,36.96 14.86,36.96 8,30.1
GND_IN on Bottom Layer: 7.87,20.7 7.87,29.49 10.69,29.49 11.05,29.84 11.05,31.11 5.21,31.11 5.21,19.3 12.81,11.7 12.81,9.78 15.75,9.78 15.75,12.95 8,20.7
GND_IN on GND02: 0.16,37.69 46.36,37.69 46.36,0.16 0.16,0.16
GND_IN on PWR03: 0.16,37.69 46.36,37.69 46.36,0.16 0.16,0.16
GNDP on Top Layer: 89.41,18.42 91.31,18.42 91.31,16.51 89.41,16.51
GNDP on Top Layer: 91.34,7.98 91.34,6.98 90.93,6.98 90.42,6.48 90.42,4.7 88.85,4.7 88.85,8 91.32,8
GNDP on Top Layer: 86.18,6.6 63.12,6.6 63.12,4.57 90.55,4.57 90.55,6.6 86.18,6.6
GNDP on Top Layer: 89.28,28.7 91.31,28.7 91.31,26.8 89.28,26.8
GNDP on Bottom Layer: 87.63,18.54 91.31,18.54 91.31,16.64 87.63,16.64
GNDP on Bottom Layer: 87.63,28.83 91.31,28.83 91.31,26.92 87.63,26.92
GNDP on Bottom Layer: 87.69,8.05 91.37,8.05 91.37,6.15 87.69,6.15
GNDP on Bottom Layer: 87.63,36.73 89.57,36.73 89.57,4.57 87.63,4.57
GNDP on GND02: 47.12,37.69 99.85,37.69 99.85,0.16 47.12,0.16
GNDP on PWR03: 47.12,37.69 99.85,37.69 99.85,0.16 47.12,0.16
VBUS on Top Layer: 69.09,9.53 72.14,9.53 72.14,7.11 69.09,7.11
VBUS on Top Layer: 89.54,26.67 93.35,26.67 93.35,24.15 89.54,24.15
VBUS on Top Layer: 0,8.64 42.16,8.64 42.16,3.43 91.44,3.43 91.44,5.72 93.42,5.72 93.42,2.24 92.58,1.4 1.55,1.4 0,2.94
VBUS on Top Layer: 89.54,36.7 93.35,36.7 93.35,34.18 89.54,34.18
VBUS on Top Layer: 89.54,16.26 93.35,16.26 93.35,13.73 89.54,13.73
VBUS on Top Layer: 8,28.58 8,26.92 13.21,26.92 14.86,28.58 17.02,28.58 17.02,32.39 15.62,32.39 11.81,28.58
VBUS on Bottom Layer: 91.57,36.7 93.35,36.7 93.35,3.56 91.57,3.56
VBUS on Bottom Layer: 89.88,26.67 93.35,26.67 93.35,24.15 89.88,24.15
VBUS on Bottom Layer: 89.88,16.26 93.35,16.26 93.35,13.73 89.88,13.73
VBUS on Bottom Layer: 8.89,28.58 8.89,21.21 16.76,13.33 16.76,8.64 16.64,8.51 12.83,8.51 12.83,5.84 19.3,5.84 19.3,14.22 11.05,22.48 11.05,28.58
VBUS on Bottom Layer: 89.88,36.7 93.35,36.7 93.35,34.18 89.88,34.18
VBUS on Bottom Layer: 69.47,9.4 71.68,9.4 71.68,1.4 69.47,1.4
VCC_3V3 on Top Layer: 47.86,29.73 45.7,29.73 45.7,31.77 47.86,31.77
VCC_3V3 on Top Layer: 39.11,32.77 41.78,32.77 41.78,29.34 39.11,29.34
VCC_3V3 on PWR03: 39.1,32.77 46.61,32.77 46.61,29.59 39.1,29.59
VCC_5V on Top Layer: 18.29,24.77 24,24.77 25.15,25.91 25.15,29.21 28.18,29.21 28.18,24.11 26.54,22.48 18.29,22.48
VCC_12V on Top Layer: 74.42,9.53 76.61,9.53 76.61,6.87 74.42,6.87
VDD_3V3 on Top Layer: 56.9,30.1 59.33,27.79 59.33,27.59 57.01,27.59 56.39,28.2 55.61,28.2 55.5,28.31 55.5,32 56.9,32
VDD_3V3 on Top Layer: 48.13,31.75 50.29,31.75 50.29,29.72 48.13,29.72
VDD_3V3 on Top Layer: 44.2,23.75 45.99,23.75 45.99,22.06 44.2,22.06
VDD_3V3 on PWR03: 30.11,37.69 68.07,37.69 68.07,9.29 30.11,9.29
OUT1 on Top Layer: 89.54,13.21 95.27,13.21 95.27,8.91 89.54,8.91
OUT1 on Bottom Layer: 89.83,13.06 91.3,13.06 91.3,8.65 89.83,8.65
OUT2 on Top Layer: 89.54,23.5 95.52,23.5 95.52,19.32 89.54,19.32
OUT2 on Bottom Layer: 89.92,23.5 91.31,23.5 91.31,19.07 89.92,19.07
OUT3 on Top Layer: 89.54,33.53 95.52,33.53 95.52,29.35 89.54,29.35
OUT3 on Bottom Layer: 89.92,33.53 91.31,33.53 91.31,29.35 89.92,29.35
VBOOST on Top Layer: 75.44,16.89 78.99,16.89 78.99,12.7 75.44,12.7
$1N16158 on Top Layer: 17.4,28.32 19.05,28.32 19.05,26.31 17.4,26.31
$1N26213 on Top Layer: 16.76,28.32 17.25,27.83 17.25,26.15 17.33,26.07 21.64,26.07 21.96,26.38 21.96,27.85 22.01,27.9 23.67,27.9 23.76,27.81 23.76,25.8 22.96,25 17.77,25 17.5,24.73 17.5,22.53 17.46,22.48 16.18,22.48 15.69,22.98 15.69,28.32
$1N26450 on Top Layer: 31.24,30.61 38.99,30.61 38.99,25.4 31.24,25.4

## Text on the board
Top Silkscreen Layer: GND
